# EAGLE design QuadroAmps_panel (EAGLE 6.6.0)
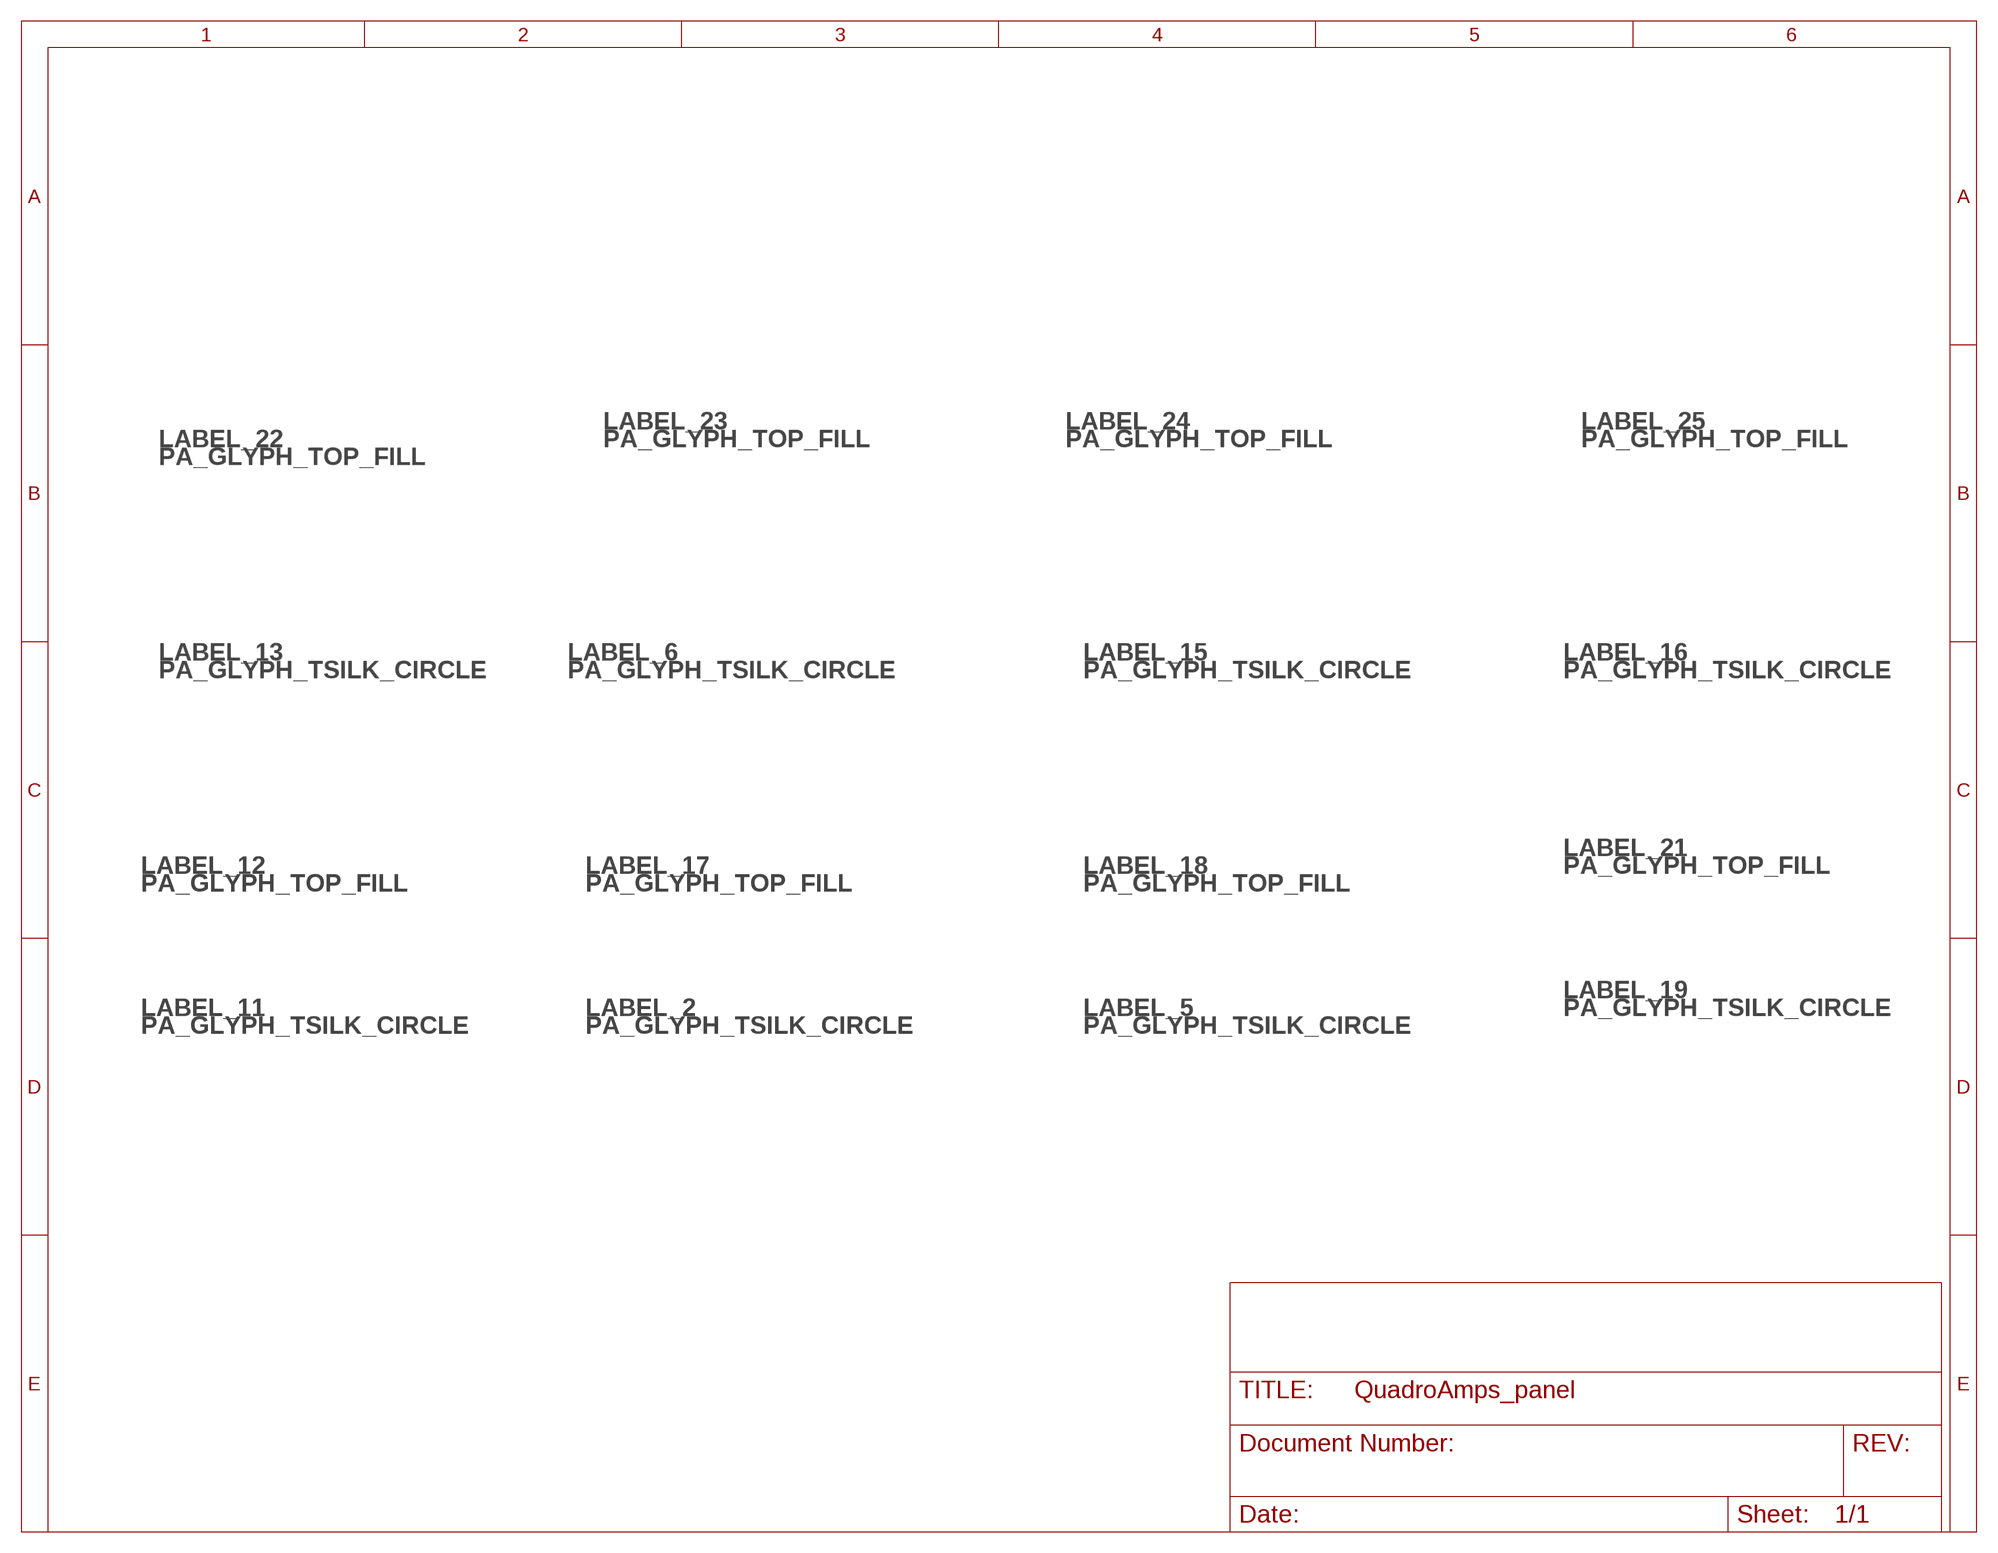
[diagram p0: schematic, sheet 1]

## Parts
LABEL_2  PA_GLYPH_TSILK_CIRCLE  [GLY_TSILK_CIRCLE]
LABEL_5  PA_GLYPH_TSILK_CIRCLE  [GLY_TSILK_CIRCLE]
LABEL_6  PA_GLYPH_TSILK_CIRCLE  [GLY_TSILK_CIRCLE]
LABEL_11  PA_GLYPH_TSILK_CIRCLE  [GLY_TSILK_CIRCLE]
LABEL_12  PA_GLYPH_TOP_FILL  [GLY_TOP_FILL]
LABEL_13  PA_GLYPH_TSILK_CIRCLE  [GLY_TSILK_CIRCLE]
LABEL_15  PA_GLYPH_TSILK_CIRCLE  [GLY_TSILK_CIRCLE]
LABEL_16  PA_GLYPH_TSILK_CIRCLE  [GLY_TSILK_CIRCLE]
LABEL_17  PA_GLYPH_TOP_FILL  [GLY_TOP_FILL]
LABEL_18  PA_GLYPH_TOP_FILL  [GLY_TOP_FILL]
LABEL_19  PA_GLYPH_TSILK_CIRCLE  [GLY_TSILK_CIRCLE]
LABEL_21  PA_GLYPH_TOP_FILL  [GLY_TOP_FILL]
LABEL_22  PA_GLYPH_TOP_FILL  [GLY_TOP_FILL]
LABEL_23  PA_GLYPH_TOP_FILL  [GLY_TOP_FILL]
LABEL_24  PA_GLYPH_TOP_FILL  [GLY_TOP_FILL]
LABEL_25  PA_GLYPH_TOP_FILL  [GLY_TOP_FILL]

## Library data of the parts
LABEL_2 LABEL_5 LABEL_6 LABEL_11-LABEL_13 LABEL_15-LABEL_19 LABEL_21-LABEL_25 = PatternAgents-Logos:PA_GLYPH

## Board
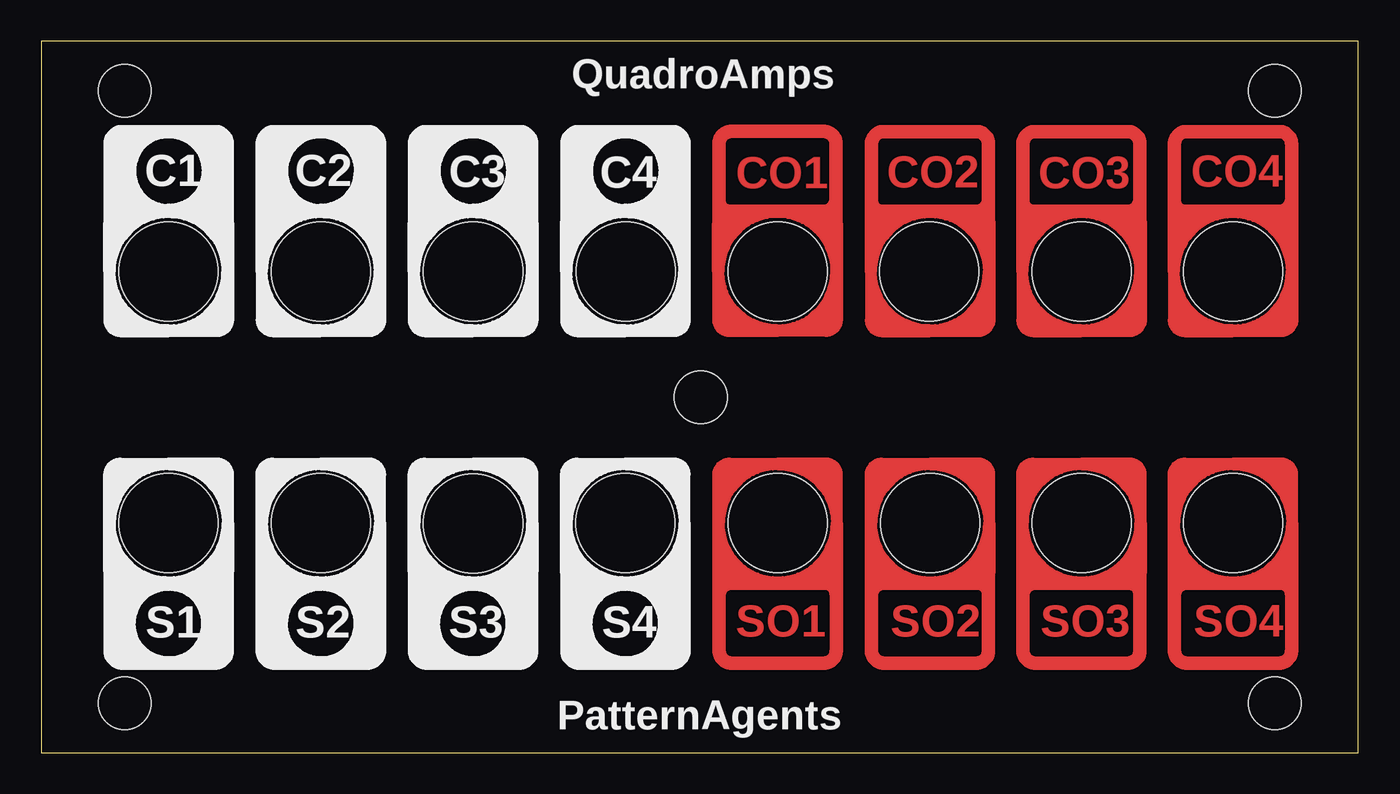
[diagram p1: board, top side]
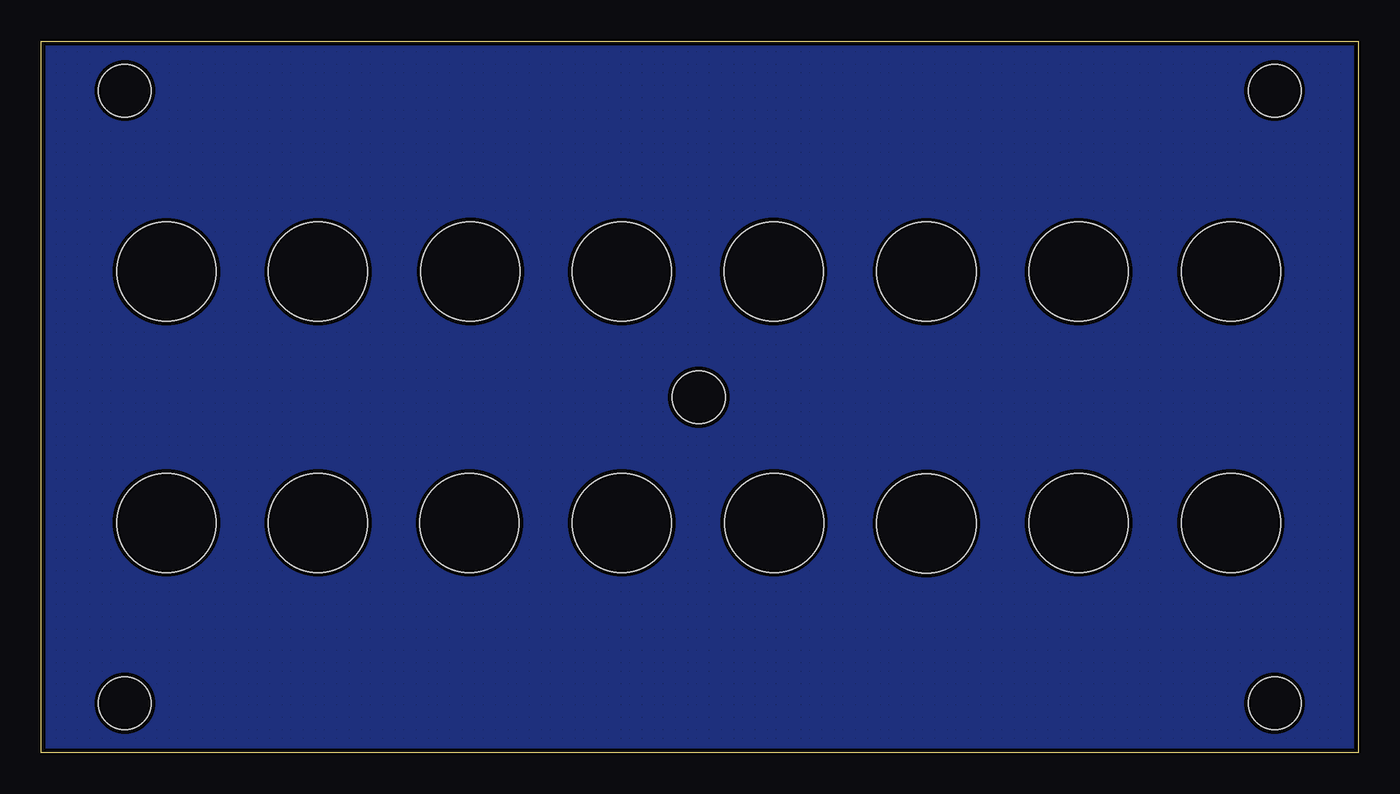
[diagram p2: board, bottom side, seen from below]

Size 79.96 x 43.18 mm. Coordinates in mm from the lower left corner, seen from the top.
Outline: 79.96,43.18 0,43.18 0,0 79.96,0 79.96,43.18
Copper layers (1*16): Top 0.035mm / dielectric 1.5mm / Bottom 0.035mm
Design rules "PatternAgents_7mil": minimum track width 7mil, minimum drill 14mil, track to track 7mil, track to pad 7mil, pad to pad 7mil, via to via 7mil, smd to smd 7mil, copper to edge 7mil, drill to drill 7mil, minimum pad ring 12mil, minimum via ring 10mil, stop-mask expansion 4mil, vias tented up to drill 25mil, thermal gap 7mil
Holes 3.2 mm at 40.04,21.57
Holes 6 mm at 7.74,29.19 16.98,29.19 26.22,29.19 35.5,29.2 44.71,29.19 53.9,29.2 63.15,29.19 72.35,29.19 7.74,13.95 16.98,13.95 26.22,13.91 35.47,13.95 44.71,13.95 53.96,13.95 63.15,13.95 72.35,13.95
Holes 3.17 mm at 5.08,40.18 5.08,3 74.88,40.18 74.88,3

### Placement (x,y rotation side)
LABEL_2  16.98,13.95 0 top
LABEL_5  26.22,13.95 0 top
LABEL_6  16.98,29.19 180 top
LABEL_11  7.74,13.95 0 top
LABEL_12  44.71,13.95 0 top
LABEL_13  7.74,29.19 180 top
LABEL_15  26.22,29.19 180 top
LABEL_16  35.47,29.19 180 top
LABEL_17  53.96,13.95 0 top
LABEL_18  63.15,13.95 0 top
LABEL_19  35.47,13.95 0 top
LABEL_21  72.35,13.95 0 top
LABEL_22  44.7,29.2 180 top
LABEL_23  53.96,29.19 180 top
LABEL_24  63.15,29.19 180 top
LABEL_25  72.35,29.19 180 top

### Tracks (layer width: path | path; a pad name or v marks a point on that pad's centre or on a via)
GND
  pour Bottom (isolate 0.254, hatched): 0,0 0,43.2 80,43.2 80,0

### Text on the board
Top: CO1 | CO2 | CO3 | CO4 | SO1 | SO2 | SO3 | SO4
tPlace: QuadroAmps | C1 | C2 | C3 | C4 | S1 | S2 | S3 | S4 | PatternAgents
tStop: CO1 | CO2 | CO3 | CO4 | SO1 | SO2 | SO3 | SO4